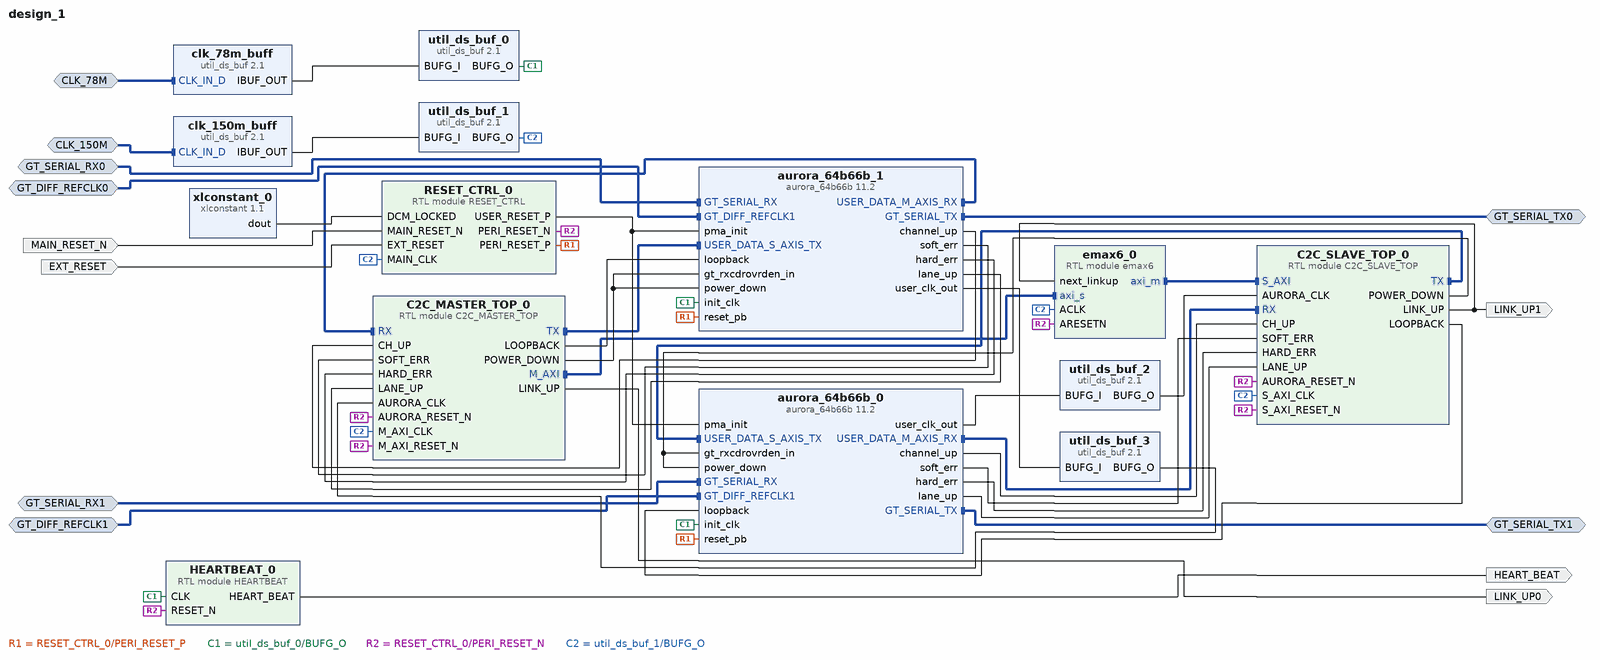
[diagram p0: block diagram of the top level]
# Vivado block design design_1, xcvu440-flga2892-2-e, Vivado 2018.3.1
create_bd_design design_1

create_bd_intf_port -mode Master -vlnv xilinx.com:display_aurora:GT_Serial_Transceiver_Pins_TX_rtl:1.0 GT_SERIAL_TX0
create_bd_intf_port -mode Slave -vlnv xilinx.com:interface:diff_clock_rtl:1.0 GT_DIFF_REFCLK0
set_property -dict {CONFIG.FREQ_HZ 156250000} [get_bd_intf_ports GT_DIFF_REFCLK0]
create_bd_intf_port -mode Slave -vlnv xilinx.com:display_aurora:GT_Serial_Transceiver_Pins_RX_rtl:1.0 GT_SERIAL_RX0
create_bd_intf_port -mode Master -vlnv xilinx.com:display_aurora:GT_Serial_Transceiver_Pins_TX_rtl:1.0 GT_SERIAL_TX1
create_bd_intf_port -mode Slave -vlnv xilinx.com:interface:diff_clock_rtl:1.0 GT_DIFF_REFCLK1
set_property -dict {CONFIG.FREQ_HZ 156250000} [get_bd_intf_ports GT_DIFF_REFCLK1]
create_bd_intf_port -mode Slave -vlnv xilinx.com:display_aurora:GT_Serial_Transceiver_Pins_RX_rtl:1.0 GT_SERIAL_RX1
create_bd_intf_port -mode Slave -vlnv xilinx.com:interface:diff_clock_rtl:1.0 CLK_78M
set_property -dict {CONFIG.FREQ_HZ 78125000} [get_bd_intf_ports CLK_78M]
create_bd_intf_port -mode Slave -vlnv xilinx.com:interface:diff_clock_rtl:1.0 CLK_150M
set_property -dict {CONFIG.FREQ_HZ 150000000} [get_bd_intf_ports CLK_150M]
create_bd_port -dir O LINK_UP0
create_bd_port -dir O LINK_UP1
create_bd_port -dir I MAIN_RESET_N
create_bd_port -dir I -type rst EXT_RESET
set_property -dict {CONFIG.POLARITY ACTIVE_HIGH} [get_bd_ports EXT_RESET]
create_bd_port -dir O HEART_BEAT

create_bd_cell -type ip -vlnv xilinx.com:ip:util_ds_buf:2.1 clk_78m_buff
create_bd_cell -type ip -vlnv xilinx.com:ip:util_ds_buf:2.1 clk_150m_buff
create_bd_cell -type ip -vlnv xilinx.com:ip:util_ds_buf:2.1 util_ds_buf_0
set_property -dict {CONFIG.C_BUF_TYPE BUFG} [get_bd_cells util_ds_buf_0]
create_bd_cell -type ip -vlnv xilinx.com:ip:util_ds_buf:2.1 util_ds_buf_1
set_property -dict {CONFIG.C_BUF_TYPE BUFG} [get_bd_cells util_ds_buf_1]
create_bd_cell -type ip -vlnv xilinx.com:ip:aurora_64b66b:11.2 aurora_64b66b_0
set_property -dict [list \
  CONFIG.CHANNEL_ENABLE {X0Y0 X0Y1 X0Y2 X0Y3 X0Y4 X0Y5 X0Y6 X0Y7} \
  CONFIG.C_AURORA_LANES 8 \
  CONFIG.C_GT_LOC_5 5 \
  CONFIG.C_GT_LOC_6 6 \
  CONFIG.C_GT_LOC_7 7 \
  CONFIG.C_GT_LOC_8 8 \
  CONFIG.C_LINE_RATE 5 \
  CONFIG.C_USE_BYTESWAP true \
  CONFIG.C_active_transceiverquads 2 \
  CONFIG.SupportLevel 1 \
  CONFIG.drp_mode Disabled \
] [get_bd_cells aurora_64b66b_0]
create_bd_cell -type ip -vlnv xilinx.com:ip:aurora_64b66b:11.2 aurora_64b66b_1
set_property -dict [list \
  CONFIG.CHANNEL_ENABLE {X0Y0 X0Y1 X0Y2 X0Y3 X0Y4 X0Y5 X0Y6 X0Y7} \
  CONFIG.C_AURORA_LANES 8 \
  CONFIG.C_GT_LOC_5 5 \
  CONFIG.C_GT_LOC_6 6 \
  CONFIG.C_GT_LOC_7 7 \
  CONFIG.C_GT_LOC_8 8 \
  CONFIG.C_LINE_RATE 5 \
  CONFIG.C_USE_BYTESWAP true \
  CONFIG.C_active_transceiverquads 2 \
  CONFIG.SupportLevel 1 \
  CONFIG.drp_mode Disabled \
] [get_bd_cells aurora_64b66b_1]
create_bd_cell -type ip -vlnv xilinx.com:ip:util_ds_buf:2.1 util_ds_buf_2
set_property -dict {CONFIG.C_BUF_TYPE BUFG} [get_bd_cells util_ds_buf_2]
create_bd_cell -type ip -vlnv xilinx.com:ip:util_ds_buf:2.1 util_ds_buf_3
set_property -dict {CONFIG.C_BUF_TYPE BUFG} [get_bd_cells util_ds_buf_3]
create_bd_cell -type ip -vlnv xilinx.com:ip:xlconstant:1.1 xlconstant_0
create_bd_cell -type module -reference HEARTBEAT HEARTBEAT_0
create_bd_cell -type module -reference RESET_CTRL RESET_CTRL_0
create_bd_cell -type module -reference C2C_MASTER_TOP C2C_MASTER_TOP_0
create_bd_cell -type module -reference C2C_SLAVE_TOP C2C_SLAVE_TOP_0
create_bd_cell -type module -reference emax6 emax6_0

# ---- connections ----

connect_bd_intf_net [get_bd_intf_pins emax6_0/axi_m] [get_bd_intf_pins C2C_SLAVE_TOP_0/S_AXI]
connect_bd_intf_net [get_bd_intf_ports CLK_78M] [get_bd_intf_pins clk_78m_buff/CLK_IN_D]
connect_bd_intf_net -intf_net GT_SERIAL_RX0_1 [get_bd_intf_ports GT_SERIAL_RX0] [get_bd_intf_pins aurora_64b66b_1/GT_SERIAL_RX]
connect_bd_intf_net -intf_net GT_SERIAL_RX1_1 [get_bd_intf_ports GT_SERIAL_RX1] [get_bd_intf_pins aurora_64b66b_0/GT_SERIAL_RX]
connect_bd_intf_net [get_bd_intf_pins C2C_SLAVE_TOP_0/TX] [get_bd_intf_pins aurora_64b66b_0/USER_DATA_S_AXIS_TX]
connect_bd_intf_net -intf_net GT_DIFF_REFCLK0_1 [get_bd_intf_ports GT_DIFF_REFCLK0] [get_bd_intf_pins aurora_64b66b_1/GT_DIFF_REFCLK1]
connect_bd_intf_net [get_bd_intf_pins C2C_MASTER_TOP_0/M_AXI] [get_bd_intf_pins emax6_0/axi_s]
connect_bd_intf_net [get_bd_intf_ports GT_SERIAL_TX0] [get_bd_intf_pins aurora_64b66b_1/GT_SERIAL_TX]
connect_bd_intf_net [get_bd_intf_ports GT_SERIAL_TX1] [get_bd_intf_pins aurora_64b66b_0/GT_SERIAL_TX]
connect_bd_intf_net [get_bd_intf_pins aurora_64b66b_0/USER_DATA_M_AXIS_RX] [get_bd_intf_pins C2C_SLAVE_TOP_0/RX]
connect_bd_intf_net [get_bd_intf_pins C2C_MASTER_TOP_0/TX] [get_bd_intf_pins aurora_64b66b_1/USER_DATA_S_AXIS_TX]
connect_bd_intf_net [get_bd_intf_pins aurora_64b66b_1/USER_DATA_M_AXIS_RX] [get_bd_intf_pins C2C_MASTER_TOP_0/RX]
connect_bd_intf_net -intf_net GT_DIFF_REFCLK1_1 [get_bd_intf_ports GT_DIFF_REFCLK1] [get_bd_intf_pins aurora_64b66b_0/GT_DIFF_REFCLK1]
connect_bd_intf_net [get_bd_intf_ports CLK_150M] [get_bd_intf_pins clk_150m_buff/CLK_IN_D]
connect_bd_net [get_bd_pins clk_78m_buff/IBUF_OUT] [get_bd_pins util_ds_buf_0/BUFG_I]
connect_bd_net [get_bd_pins clk_150m_buff/IBUF_OUT] [get_bd_pins util_ds_buf_1/BUFG_I]
connect_bd_net [get_bd_pins C2C_SLAVE_TOP_0/POWER_DOWN] [get_bd_pins aurora_64b66b_0/gt_rxcdrovrden_in] [get_bd_pins aurora_64b66b_0/power_down]
connect_bd_net [get_bd_pins C2C_SLAVE_TOP_0/LOOPBACK] [get_bd_pins aurora_64b66b_0/loopback]
connect_bd_net [get_bd_pins aurora_64b66b_0/channel_up] [get_bd_pins C2C_SLAVE_TOP_0/CH_UP]
connect_bd_net [get_bd_pins aurora_64b66b_0/soft_err] [get_bd_pins C2C_SLAVE_TOP_0/SOFT_ERR]
connect_bd_net [get_bd_pins aurora_64b66b_0/hard_err] [get_bd_pins C2C_SLAVE_TOP_0/HARD_ERR]
connect_bd_net [get_bd_pins aurora_64b66b_0/lane_up] [get_bd_pins C2C_SLAVE_TOP_0/LANE_UP]
connect_bd_net [get_bd_pins aurora_64b66b_1/channel_up] [get_bd_pins C2C_MASTER_TOP_0/CH_UP]
connect_bd_net [get_bd_pins aurora_64b66b_1/soft_err] [get_bd_pins C2C_MASTER_TOP_0/SOFT_ERR]
connect_bd_net [get_bd_pins aurora_64b66b_1/hard_err] [get_bd_pins C2C_MASTER_TOP_0/HARD_ERR]
connect_bd_net [get_bd_pins aurora_64b66b_1/lane_up] [get_bd_pins C2C_MASTER_TOP_0/LANE_UP]
connect_bd_net [get_bd_pins aurora_64b66b_0/user_clk_out] [get_bd_pins util_ds_buf_2/BUFG_I]
connect_bd_net [get_bd_pins util_ds_buf_2/BUFG_O] [get_bd_pins C2C_SLAVE_TOP_0/AURORA_CLK]
connect_bd_net [get_bd_pins aurora_64b66b_1/user_clk_out] [get_bd_pins util_ds_buf_3/BUFG_I]
connect_bd_net [get_bd_pins util_ds_buf_3/BUFG_O] [get_bd_pins C2C_MASTER_TOP_0/AURORA_CLK]
connect_bd_net [get_bd_pins C2C_MASTER_TOP_0/LOOPBACK] [get_bd_pins aurora_64b66b_1/loopback]
connect_bd_net [get_bd_pins RESET_CTRL_0/USER_RESET_P] [get_bd_pins aurora_64b66b_0/pma_init] [get_bd_pins aurora_64b66b_1/pma_init]
connect_bd_net [get_bd_pins RESET_CTRL_0/PERI_RESET_P] [get_bd_pins aurora_64b66b_1/reset_pb] [get_bd_pins aurora_64b66b_0/reset_pb]
connect_bd_net [get_bd_pins HEARTBEAT_0/HEART_BEAT] [get_bd_ports HEART_BEAT]
connect_bd_net [get_bd_pins util_ds_buf_0/BUFG_O] \
  [get_bd_pins aurora_64b66b_0/init_clk] [get_bd_pins aurora_64b66b_1/init_clk] [get_bd_pins HEARTBEAT_0/CLK]
connect_bd_net [get_bd_pins RESET_CTRL_0/PERI_RESET_N] \
  [get_bd_pins HEARTBEAT_0/RESET_N] [get_bd_pins C2C_MASTER_TOP_0/M_AXI_RESET_N] \
  [get_bd_pins C2C_MASTER_TOP_0/AURORA_RESET_N] [get_bd_pins C2C_SLAVE_TOP_0/S_AXI_RESET_N] \
  [get_bd_pins C2C_SLAVE_TOP_0/AURORA_RESET_N] [get_bd_pins emax6_0/ARESETN]
connect_bd_net [get_bd_pins xlconstant_0/dout] [get_bd_pins RESET_CTRL_0/DCM_LOCKED]
connect_bd_net [get_bd_ports MAIN_RESET_N] [get_bd_pins RESET_CTRL_0/MAIN_RESET_N]
connect_bd_net [get_bd_ports EXT_RESET] [get_bd_pins RESET_CTRL_0/EXT_RESET]
connect_bd_net [get_bd_pins C2C_MASTER_TOP_0/LINK_UP] [get_bd_ports LINK_UP0]
connect_bd_net [get_bd_pins C2C_SLAVE_TOP_0/LINK_UP] [get_bd_ports LINK_UP1] [get_bd_pins emax6_0/next_linkup]
connect_bd_net [get_bd_pins util_ds_buf_1/BUFG_O] \
  [get_bd_pins RESET_CTRL_0/MAIN_CLK] [get_bd_pins C2C_MASTER_TOP_0/M_AXI_CLK] [get_bd_pins C2C_SLAVE_TOP_0/S_AXI_CLK] \
  [get_bd_pins emax6_0/ACLK]
connect_bd_net [get_bd_pins C2C_MASTER_TOP_0/POWER_DOWN] [get_bd_pins aurora_64b66b_1/gt_rxcdrovrden_in] [get_bd_pins aurora_64b66b_1/power_down]

# ---- address map ----
assign_bd_address -offset 0x0000000000 -range 1T -target_address_space [get_bd_addr_spaces C2C_MASTER_TOP_0/M_AXI] [get_bd_addr_segs emax6_0/axi_s/reg0]
assign_bd_address -offset 0x0000000000 -range 1T -target_address_space [get_bd_addr_spaces emax6_0/axi_m] [get_bd_addr_segs C2C_SLAVE_TOP_0/S_AXI/reg0]

validate_bd_design
save_bd_design
